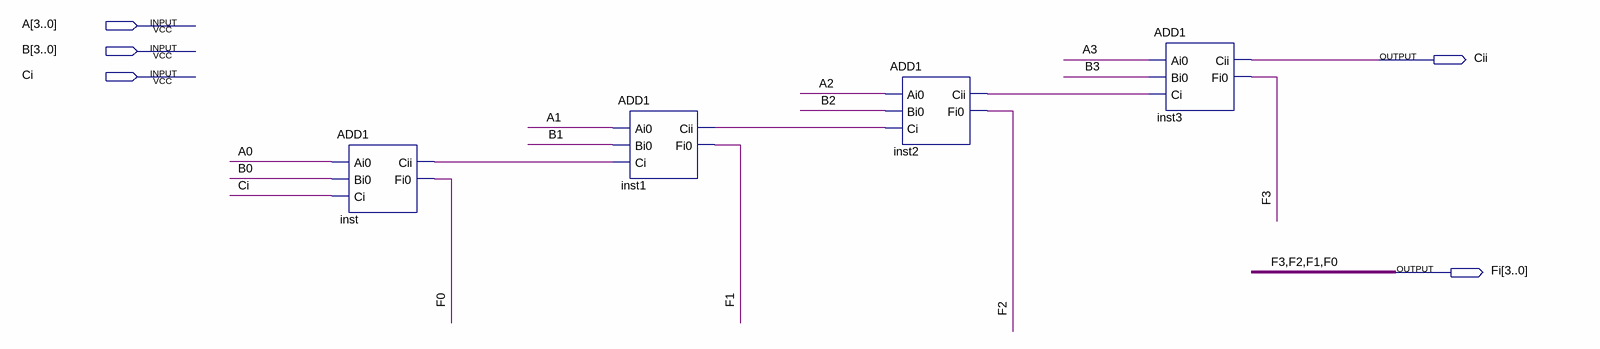
[diagram p0: schematic sheet]
// Quartus schematic ADD4.bdf as structural Verilog: 4 symbols, 5 pins
module ADD4 (
  input  [3:0] A,
  input  [3:0] B,
  input  Ci,
  output Cii,
  output [3:0] Fi
);

  wire inst1_cii, inst2_cii, inst_cii;

  ADD1 inst (.Ai0(A[0]), .Bi0(B[0]), .Ci(Ci), .Cii(inst_cii), .Fi0(Fi[0]));
  ADD1 inst1 (.Ai0(A[1]), .Bi0(B[1]), .Ci(inst_cii), .Cii(inst1_cii), .Fi0(Fi[1]));
  ADD1 inst2 (.Ai0(A[2]), .Bi0(B[2]), .Ci(inst1_cii), .Cii(inst2_cii), .Fi0(Fi[2]));
  ADD1 inst3 (.Ai0(A[3]), .Bi0(B[3]), .Ci(inst2_cii), .Cii(Cii), .Fi0(Fi[3]));

  // Other names for the same wires on the sheet: F0 = Fi[0]; F1 = Fi[1]; F2 = Fi[2]; F3 = Fi[3]
endmodule
